# Altium schematic sheet USB-B-Female-90.schdoc
size 127 x 101 mm
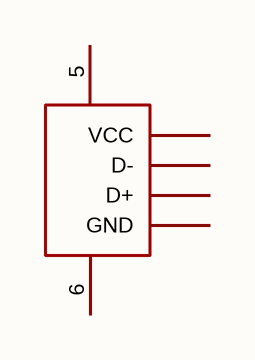
[diagram p0: USB-B-Female-90.schdoc]

## Parts
CN?  921-111a1010d10200  [USB-B_TH_USB-B-FEMALE-90]  (value not drawn)

## Nets

Not connected (* = marked no-connect by the designer): CN? 1(VCC) 2(D-) 3(D+) 4(GND) 5(SH1) 6(SH2)

## Library data of the parts
CN? = 921-111a1010d10200: 连接器类型:Type-B;协议标准:USB 2.0;公母:母;安装方式:弯插;触点数量:4P;端口数量:1;; Manufacturer: 精拓金; Symbol: USB-B-Female-90; AddInBom: yes; ModelId: 427257db465a432d8a34b597c871403b; ModelTransform: 544.04938,649.605,0,0,0,0,-0.005,-175.199,-118.11; Connector Type: Type-B; Protocol Standard: USB 2.0; Gender: 母; Number of Contacts: 4P; Number of Ports: 1; Detection color: 白色; LCSC Part Name: Type-B 母 弯插; SupplierPart: C46392; ManufacturerPart: 921-111A1010D10200; Supplier Footprint: 插件; JLCPCB Part Class: Extended Part; Datasheet: https://item.szlcsc.com/datasheet/921-111A1010D10200/47396.html; Supplier: LCSC; ConvertToPcb: yes; FootprintName: USB-B_TH_USB-B-FEMALE-90; ModelName: USB-B_TH_USB-B-FEMALE-90; Mounting Type: 弯插; Length: 16.3mm